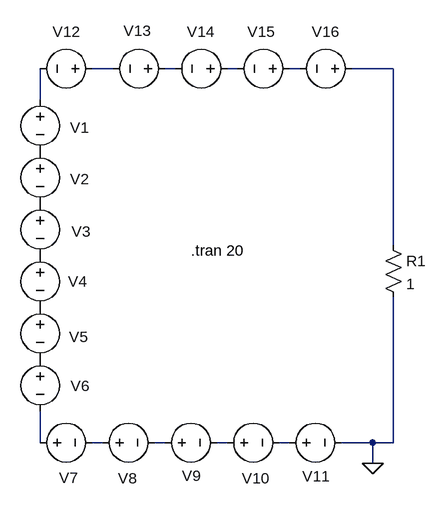
[diagram p0: schematic Parabola.asc]
Parabola.asc, the LTspice schematic file:
Version 4
SHEET 1 1740 680
WIRE -64 -32 -96 -32
WIRE 32 -32 16 -32
WIRE 128 -32 112 -32
WIRE 224 -32 208 -32
WIRE 368 -32 304 -32
WIRE -176 16 -176 -32
WIRE 368 240 368 -32
WIRE -176 544 -176 496
WIRE -80 544 -96 544
WIRE 16 544 0 544
WIRE 112 544 96 544
WIRE 208 544 192 544
WIRE 336 544 288 544
WIRE 368 544 368 320
WIRE 368 544 336 544
WIRE 336 576 336 544
FLAG 336 576 0
SYMBOL voltage -176 0 R0
WINDOW 123 0 0 Left 0
WINDOW 39 0 0 Left 0
WINDOW 0 46 59 Left 2
WINDOW 3 24 96 Invisible 2
SYMATTR InstName V1
SYMATTR Value SINE(3.28986813 -4 0.15915494 0 0 90)
SYMBOL voltage -176 80 R0
WINDOW 123 0 0 Left 0
WINDOW 39 0 0 Left 0
WINDOW 0 46 58 Left 2
WINDOW 3 24 96 Invisible 2
SYMATTR InstName V2
SYMATTR Value SINE(0 1 0.31830989 0 0 90)
SYMBOL voltage -176 160 R0
WINDOW 123 0 0 Left 0
WINDOW 39 0 0 Left 0
WINDOW 0 48 59 Left 2
WINDOW 3 24 96 Invisible 2
SYMATTR InstName V3
SYMATTR Value SINE(0 -0.4444444 0.47746483 0 0 90)
SYMBOL res 352 224 R0
SYMATTR InstName R1
SYMATTR Value 1
SYMBOL voltage -176 240 R0
WINDOW 123 0 0 Left 0
WINDOW 39 0 0 Left 0
WINDOW 0 72 56 Right 2
WINDOW 3 -65 -119 Invisible 2
SYMATTR InstName V4
SYMATTR Value SINE(0 0.25 0.63661977 0 0 90)
SYMBOL voltage -176 320 R0
WINDOW 123 0 0 Left 0
WINDOW 39 0 0 Left 0
WINDOW 0 74 61 Right 2
WINDOW 3 -65 -119 Invisible 2
SYMATTR InstName V5
SYMATTR Value SINE(0 -0.16 0.79577472 0 0 90)
SYMBOL voltage -176 400 R0
WINDOW 123 0 0 Left 0
WINDOW 39 0 0 Left 0
WINDOW 0 76 57 Right 2
WINDOW 3 -65 -119 Invisible 2
SYMATTR InstName V6
SYMATTR Value SINE(0 0.11111111 0.95492966 0 0 90)
SYMBOL voltage -192 544 R270
WINDOW 123 0 0 Left 0
WINDOW 39 0 0 Left 0
WINDOW 0 -54 45 VRight 2
WINDOW 3 -65 -119 Invisible 2
SYMATTR InstName V7
SYMATTR Value SINE(0 -0.0816327 1.11408460 0 0 90)
SYMBOL voltage -96 544 R270
WINDOW 123 0 0 Left 0
WINDOW 39 0 0 Left 0
WINDOW 0 -55 40 VRight 2
WINDOW 3 -65 -119 Invisible 2
SYMATTR InstName V8
SYMATTR Value SINE(0 0.0625 1.27323954 0 0 90)
SYMBOL voltage 0 544 R270
WINDOW 123 0 0 Left 0
WINDOW 39 0 0 Left 0
WINDOW 0 -51 42 VRight 2
WINDOW 3 -65 -119 Invisible 2
SYMATTR InstName V9
SYMATTR Value SINE(0 -0.0493827 1.43239449 0 0 90)
SYMBOL voltage 96 544 R270
WINDOW 123 0 0 Left 0
WINDOW 39 0 0 Left 0
WINDOW 0 -55 39 VRight 2
WINDOW 3 -65 -119 Invisible 2
SYMATTR InstName V10
SYMATTR Value SINE(0 0.04 1.59154943 0 0 90)
SYMBOL voltage 192 544 R270
WINDOW 123 0 0 Left 0
WINDOW 39 0 0 Left 0
WINDOW 0 -52 36 VRight 2
WINDOW 3 -65 -119 Invisible 2
SYMATTR InstName V11
SYMATTR Value SINE(0 -0.0330579 1.75070437 0 0 90)
SYMBOL voltage -80 -32 R90
WINDOW 123 0 0 Left 0
WINDOW 39 0 0 Left 0
WINDOW 0 -57 34 VRight 2
WINDOW 3 -65 -119 Invisible 2
SYMATTR InstName V12
SYMATTR Value SINE(0 0.02777778 1.90985932 0 0 90)
SYMBOL voltage 32 -32 R90
WINDOW 123 0 0 Left 0
WINDOW 39 0 0 Left 0
WINDOW 0 -58 37 VRight 2
WINDOW 3 -65 -119 Invisible 2
SYMATTR InstName V13
SYMATTR Value SINE(0 -0.0236686 2.06901426 0 0 90)
SYMBOL voltage 128 -32 R90
WINDOW 123 0 0 Left 0
WINDOW 39 0 0 Left 0
WINDOW 0 -57 35 VRight 2
WINDOW 3 -65 -119 Invisible 2
SYMATTR InstName V14
SYMATTR Value SINE(0 0.02040816 2.22816920 0 0 90)
SYMBOL voltage 224 -32 R90
WINDOW 123 0 0 Left 0
WINDOW 39 0 0 Left 0
WINDOW 0 -57 38 VRight 2
WINDOW 3 -65 -119 Invisible 2
SYMATTR InstName V15
SYMATTR Value SINE(0 -0.0177778 2.38732415 0 0 90)
SYMBOL voltage 320 -32 R90
WINDOW 123 0 0 Left 0
WINDOW 39 0 0 Left 0
WINDOW 0 -57 35 VRight 2
WINDOW 3 -65 -119 Invisible 2
SYMATTR InstName V16
SYMATTR Value SINE(0 0.015625 2.54647909 0 0 90)
TEXT 56 248 Left 2 !.tran 20

The netlist it stands for:
* Parabola.asc
V1 N006 P001 SINE(3.28986813 -4 0.15915494 0 0 90)
V2 P001 P002 SINE(0 1 0.31830989 0 0 90)
V3 P002 P003 SINE(0 -0.4444444 0.47746483 0 0 90)
R1 N005 0 1
V4 P003 P004 SINE(0 0.25 0.63661977 0 0 90)
V5 P004 P005 SINE(0 -0.16 0.79577472 0 0 90)
V6 P005 N007 SINE(0 0.11111111 0.95492966 0 0 90)
V7 N007 N008 SINE(0 -0.0816327 1.11408460 0 0 90)
V8 N008 N009 SINE(0 0.0625 1.27323954 0 0 90)
V9 N009 N010 SINE(0 -0.0493827 1.43239449 0 0 90)
V10 N010 N011 SINE(0 0.04 1.59154943 0 0 90)
V11 N011 0 SINE(0 -0.0330579 1.75070437 0 0 90)
V12 N001 N006 SINE(0 0.02777778 1.90985932 0 0 90)
V13 N002 N001 SINE(0 -0.0236686 2.06901426 0 0 90)
V14 N003 N002 SINE(0 0.02040816 2.22816920 0 0 90)
V15 N004 N003 SINE(0 -0.0177778 2.38732415 0 0 90)
V16 N005 N004 SINE(0 0.015625 2.54647909 0 0 90)
.tran 20
.backanno
.end

* Results of the author's LTspice run, read from the files saved beside the schematic
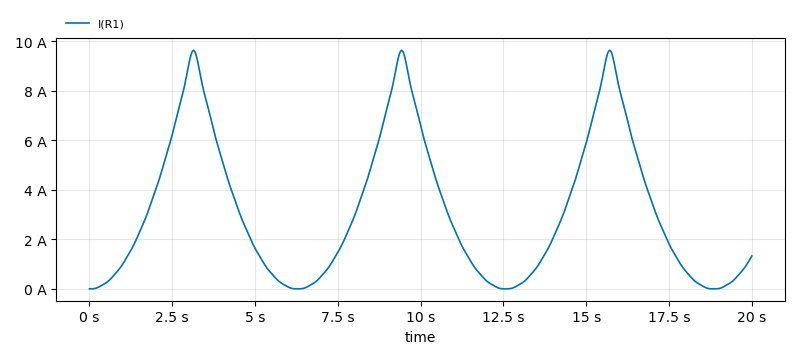
[diagram p1: Transient Analysis of Parabola.asc, plotted from the saved traces]
* Transient Analysis, 1 run:
*   I(R1): min 7.326 mA, max 9.626 A, average 3.126 A, rms 4.287 A, last 1.332 A